# EAGLE design pinky 2.1 (EAGLE 6.4)
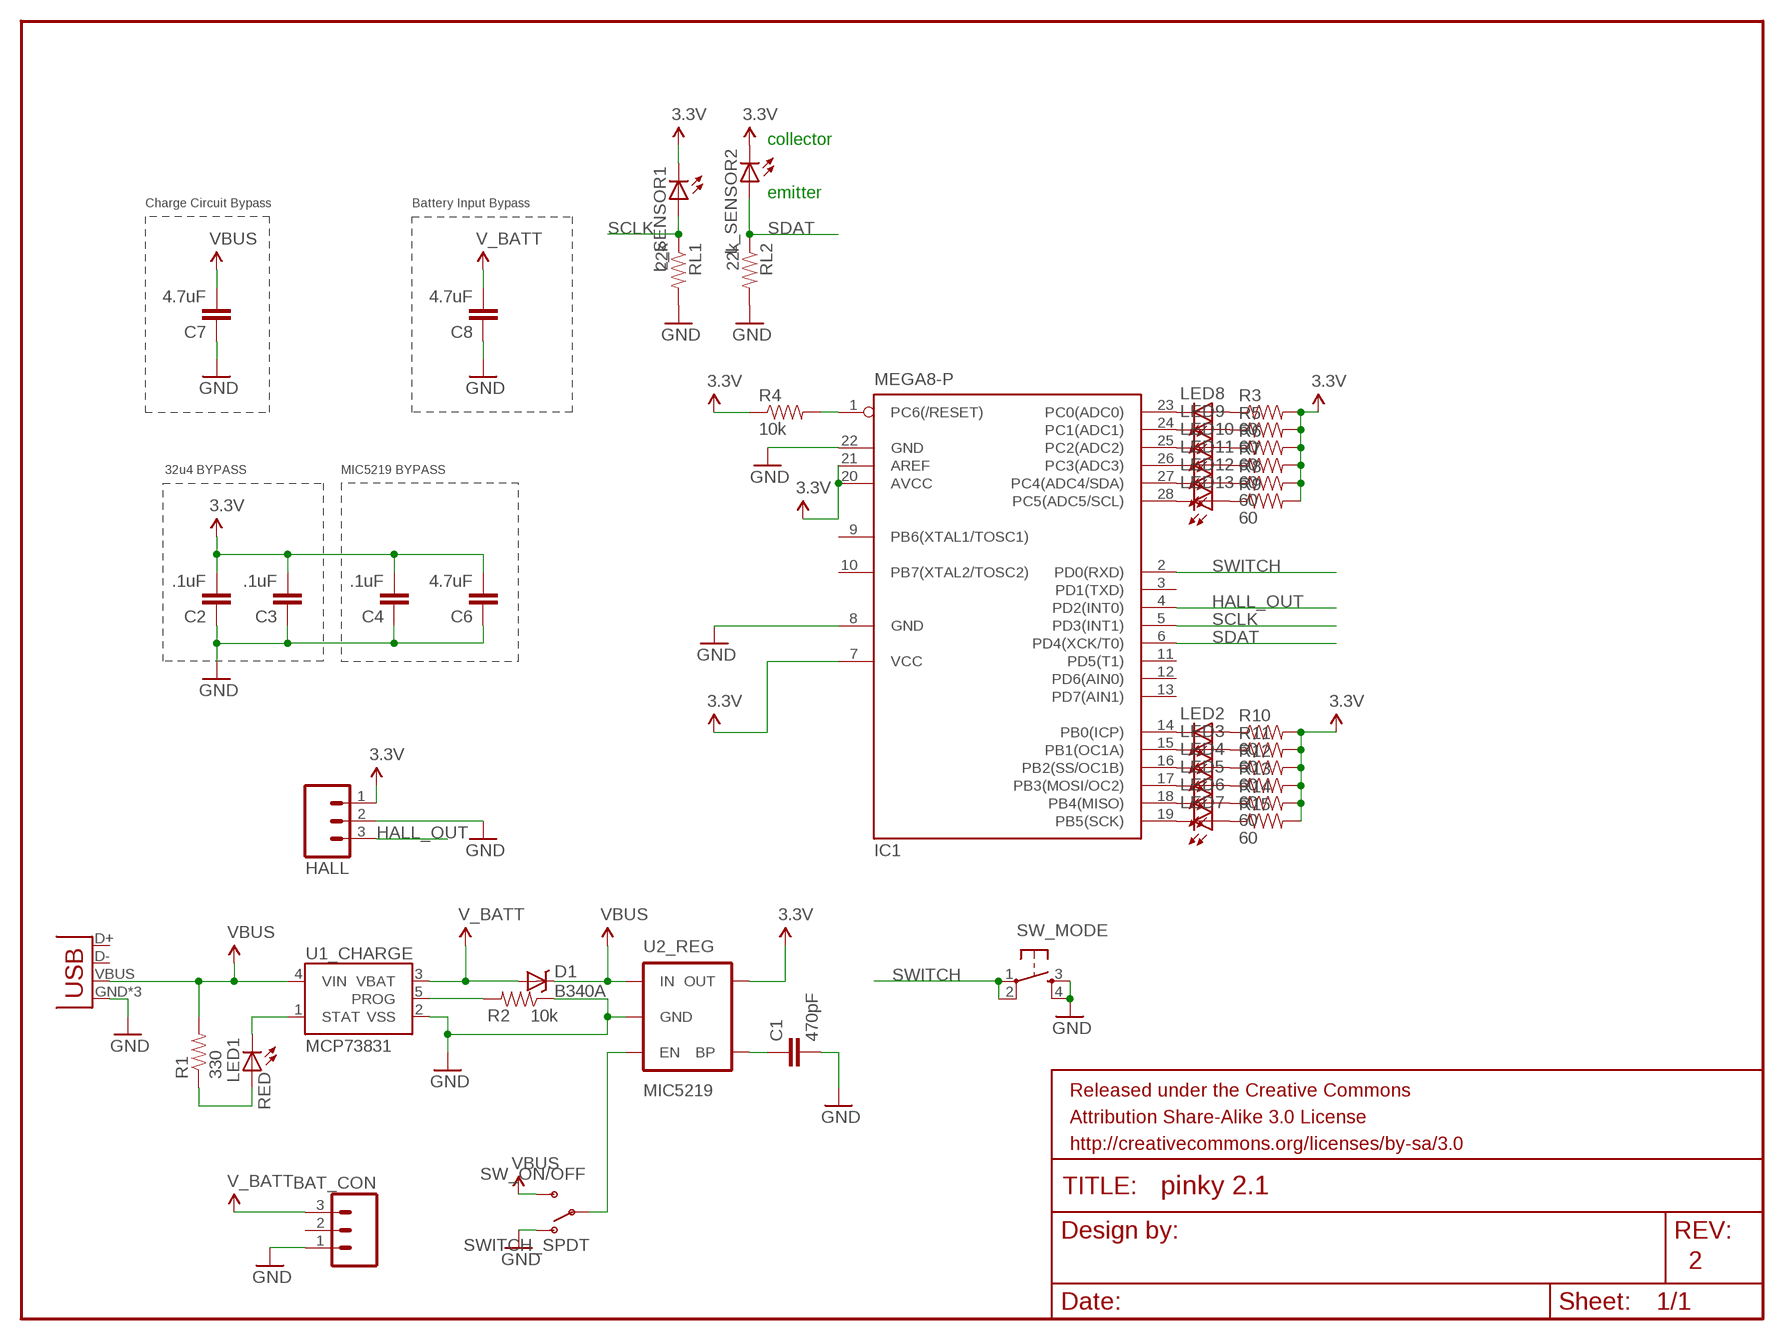
[diagram p0: schematic, sheet 1]

## Parts
BAT_CON  M03PTH  [1X03]
C1  470pF  CAP1206  [1206]
C2  .1uF  CAP1206  [1206]
C3  .1uF  CAP1206  [1206]
C4  .1uF  CAP1206  [1206]
C6  4.7uF  CAP1206  [1206]
C7  4.7uF  CAP1206  [1206]
C8  4.7uF  CAP1206  [1206]
D1  B340A  DIODE-SCHOTTKY_  [SMA-DIODE]
HALL  M03PTH  [1X03]
IC1  MEGA8-P  [DIL28-3]
L_SENSOR1  LED3MM  [LED3MM]
L_SENSOR2  LED3MM  [LED3MM]
LED1  RED  LED1206  [LED-1206]
LED2  LED1206  [LED-1206]
LED3  LED1206  [LED-1206]
LED4  LED1206  [LED-1206]
LED5  LED1206  [LED-1206]
LED6  LED1206  [LED-1206]
LED7  LED1206  [LED-1206]
LED8  LED1206  [LED-1206]
LED9  LED1206  [LED-1206]
LED10  LED1206  [LED-1206]
LED11  LED1206  [LED-1206]
LED12  LED1206  [LED-1206]
LED13  LED1206  [LED-1206]
R1  330  RESISTOR1206  [1206]
R2  10k  RESISTOR1206  [1206]
R3  60  RESISTOR1206  [1206]
R4  10k  RESISTOR1206  [1206]
R5  60  RESISTOR1206  [1206]
R6  60  RESISTOR1206  [1206]
R7  60  RESISTOR1206  [1206]
R8  60  RESISTOR1206  [1206]
R9  60  RESISTOR1206  [1206]
R10  60  RESISTOR1206  [1206]
R11  60  RESISTOR1206  [1206]
R12  60  RESISTOR1206  [1206]
R13  60  RESISTOR1206  [1206]
R14  60  RESISTOR1206  [1206]
R15  60  RESISTOR1206  [1206]
RL1  22k  RESISTOR1206  [1206]
RL2  22k  RESISTOR1206  [1206]
SW_MODE  TAC_SWITCHPTH  [TACTILE-PTH]
SW_ON/OFF  SWITCH_SPDT  [KPS-1290]
U1_CHARGE  MCP73831  [SOT23-5]
U2_REG  MIC5219  V_REG_MIC5219SMD  [SOT23-5]
X1_USB_MICRO  USB-MICROB  [USB-MICROB]

## Nets
3.3V: C2.2 C3.2 C4.2 C6.2 HALL.1 IC1.7(VCC) IC1.20(AVCC) IC1.21(AREF) L_SENSOR1.K(C) L_SENSOR2.K(C) R3.2 R4.1 R5.2 R6.2 R7.2 R8.2 R9.2 R10.2 R11.2 R12.2 R13.2 R14.2 R15.2 U2_REG.5(OUT)
5V: C7.2 D1.C R1.2 SW_ON/OFF.S U1_CHARGE.4(VIN) U2_REG.1(IN) X1_USB_MICRO.VBUS ; supply symbol labelled VBUS
GND: BAT_CON.1 C1.2 C2.1 C3.1 C4.1 C6.1 C7.1 C8.1 HALL.2 IC1.8(GND) IC1.22(GND) R2.1 RL1.2 RL2.2 SW_MODE.3 SW_MODE.4 SW_ON/OFF.O U1_CHARGE.2(VSS) U2_REG.2(GND) X1_USB_MICRO.GND X1_USB_MICRO.MT1(GND) X1_USB_MICRO.MT2(GND)
HALL_OUT: HALL.3 IC1.4(PD2(INT0))
N$1: IC1.1(PC6(/RESET)) R4.2
N$2: SW_ON/OFF.P U2_REG.3(EN)
N$3: LED1.A R1.1
N$4: LED1.C U1_CHARGE.1(STAT)
N$5: IC1.14(PB0(ICP)) LED2.C
N$6: R2.2 U1_CHARGE.5(PROG)
N$7: IC1.15(PB1(OC1A)) LED3.C
N$8: C1.1 U2_REG.4(BP)
N$9: IC1.16(PB2(SS/OC1B)) LED4.C
N$10: IC1.17(PB3(MOSI/OC2)) LED5.C
N$11: IC1.18(PB4(MISO)) LED6.C
N$12: IC1.19(PB5(SCK)) LED7.C
N$13: IC1.23(PC0(ADC0)) LED8.C
N$14: IC1.24(PC1(ADC1)) LED9.C
N$15: IC1.25(PC2(ADC2)) LED10.C
N$16: IC1.26(PC3(ADC3)) LED11.C
N$17: IC1.27(PC4(ADC4/SDA)) LED12.C
N$18: IC1.28(PC5(ADC5/SCL)) LED13.C
N$19: LED8.A R3.1
N$20: LED9.A R5.1
N$21: LED10.A R6.1
N$22: LED11.A R7.1
N$23: LED12.A R8.1
N$25: LED13.A R9.1
N$26: LED2.A R10.1
N$27: LED3.A R11.1
N$28: LED4.A R12.1
N$29: LED5.A R13.1
N$30: LED6.A R14.1
N$31: LED7.A R15.1
SCLK: IC1.5(PD3(INT1)) L_SENSOR1.A RL1.1
SDAT: IC1.6(PD4(XCK/T0)) L_SENSOR2.A RL2.1
SWITCH: IC1.2(PD0(RXD)) SW_MODE.1 SW_MODE.2
V_BATT: BAT_CON.3 C8.2 D1.A U1_CHARGE.3(VBAT)
Unconnected: BAT_CON.2 IC1.3(PD1(TXD)) IC1.9(PB6(XTAL1/TOSC1)) IC1.10(PB7(XTAL2/TOSC2)) IC1.11(PD5(T1)) IC1.12(PD6(AIN0)) IC1.13(PD7(AIN1)) X1_USB_MICRO.D+ X1_USB_MICRO.D-

## Notes on the sheet
- collector
- emitter
- Charge Circuit Bypass | Battery Input Bypass
- 32u4 BYPASS | MIC5219 BYPASS
- 2

## Library data of the parts
BAT_CON HALL = SparkFun-Connectors:M03: Header 3 Standard 3-pin 0.1" header. Use with straight break away headers (SKU : PRT-00116), right angle break away headers (PRT-00553), swiss pins (PRT-00743), machine pins (PRT-00117), and female headers (PRT-00115). Molex polarized connector foot print use with SKU : PRT-08232 with associated crimp pins and housings.
C1 = SparkFun-Passives:CAP: Capacitor Standard 0603 ceramic capacitor, and 0.1" leaded capacitor.; PROD_ID: CAP-07884
C2-C4 = SparkFun-Passives:CAP: Capacitor Standard 0603 ceramic capacitor, and 0.1" leaded capacitor.; PROD_ID: CAP-00810
C6 = SparkFun-Passives:CAP: Capacitor Standard 0603 ceramic capacitor, and 0.1" leaded capacitor.; PROD_ID: CAP-08280
C7 C8 = SparkFun-Passives:CAP: Capacitor Standard 0603 ceramic capacitor, and 0.1" leaded capacitor.; PROD_ID: CAP-10300
D1 = SparkFun-DiscreteSemi:DIODE-SCHOTTKY: Commonly MBRA140.; PROD_ID: DIO-09886
IC1 = atmel:MEGA8-P: MICROCONTROLLER 8 Kbytes FLASH, 1 kbytes SRAM, 512 bytes EEPROM, USART, 4-channel 10 bit ADC, 2-channel 8 bit ADC Pin compatible with Atmega48, ATMega88, ATMega168 Source: avr.lbr; OC_FARNELL: unknown; OC_NEWARK: unknown
L_SENSOR1 L_SENSOR2 LED2-LED13 = SparkFun-LED:LED: LEDs Standard schematic elements and footprints for 5mm, 3mm, 1206, and 0603 sized LEDs. 5mm - Spark Fun Electronics SKU : COM-00529 (and others)
LED1 = SparkFun-LED:LED: LEDs Standard schematic elements and footprints for 5mm, 3mm, 1206, and 0603 sized LEDs. 5mm - Spark Fun Electronics SKU : COM-00529 (and others); PROD_ID: DIO-00819
R1 = SparkFun-Passives:RESISTOR: Resistor Basic schematic elements and footprints for 0603, 1206, and PTH resistors.; PROD_ID: RES-00818
R2-R15 RL1 RL2 = SparkFun-Passives:RESISTOR: Resistor Basic schematic elements and footprints for 0603, 1206, and PTH resistors.; PROD_ID: RES-00824
SW_MODE = SparkFun-Electromechanical:TAC_SWITCH: Momentary Switch Button commonly used for reset or general input. Spark Fun Electronics SKU : COM-00097 SMT- SWCH-08247
SW_ON/OFF = SparkFun-Electromechanical:SWITCH_SPDT: Side-actuated SPDT slide switch, as used on the Arduino Pro
U1_CHARGE = SparkFun-PowerIC:MCP73831: Miniature single cell, fully integrated Li-Ion, Li-polymer charge management controller http://ww1.microchip.com/downloads/en/DeviceDoc/21984a.pdf; PROD_ID: IC-09995
U2_REG = SparkFun-PowerIC:V_REG_MIC5219: V_REG MIC5219 Standard 500mA LDO voltage regulator in SOT-23 layout. Micrel part MIC5219. BP (by-pass) pin is used to lower output noise with 470pF cap, may be left open.; PROD_ID: VREG-09872
X1_USB_MICRO = SparkFun-Connectors:USB: USB Connectors USB-B-PTH is fully proven SKU : PRT-00139 USB-miniB is fully proven SKU : PRT-00587 USB-A-PCB is untested. USB-A-H is throughly reviewed, but untested. Spark Fun Electronics SKU : PRT-00437 USB-B-SMT is throughly reviewed, but untested. Needs silkscreen touching up. USB-A-S has not been used/tested USB-MB-H has not been used/tested; PROD_ID: CONN-09505

## Board
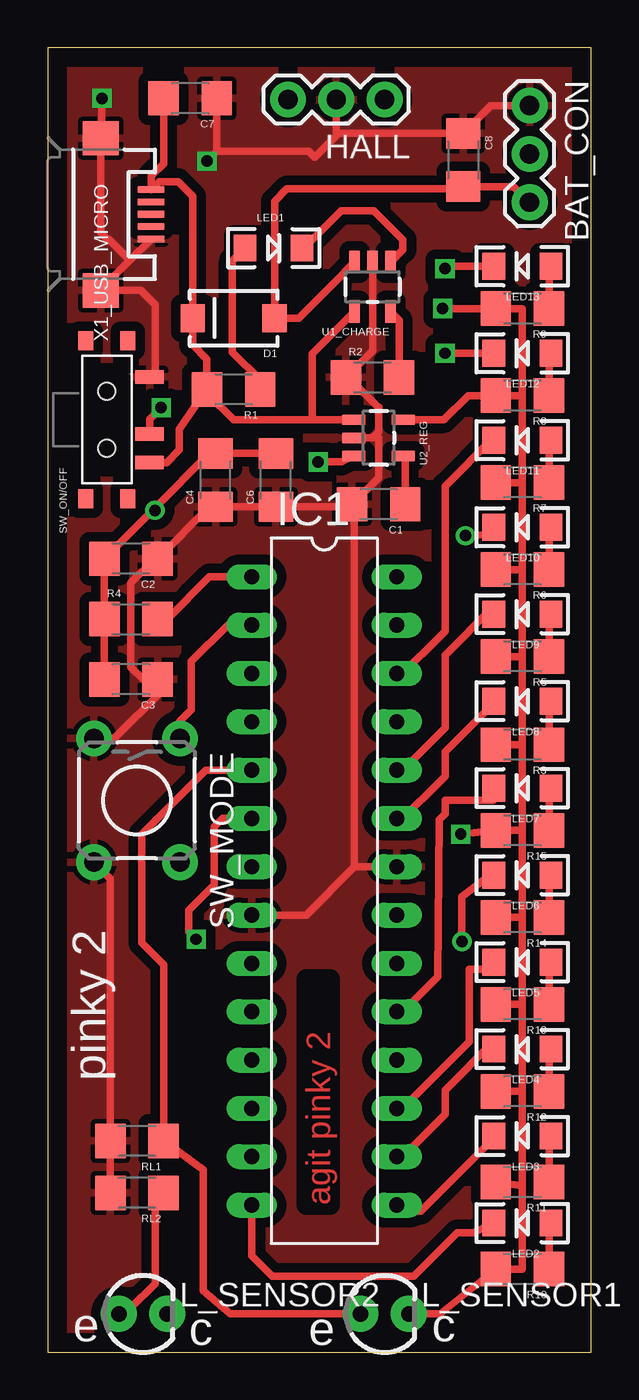
[diagram p1: board, top side]
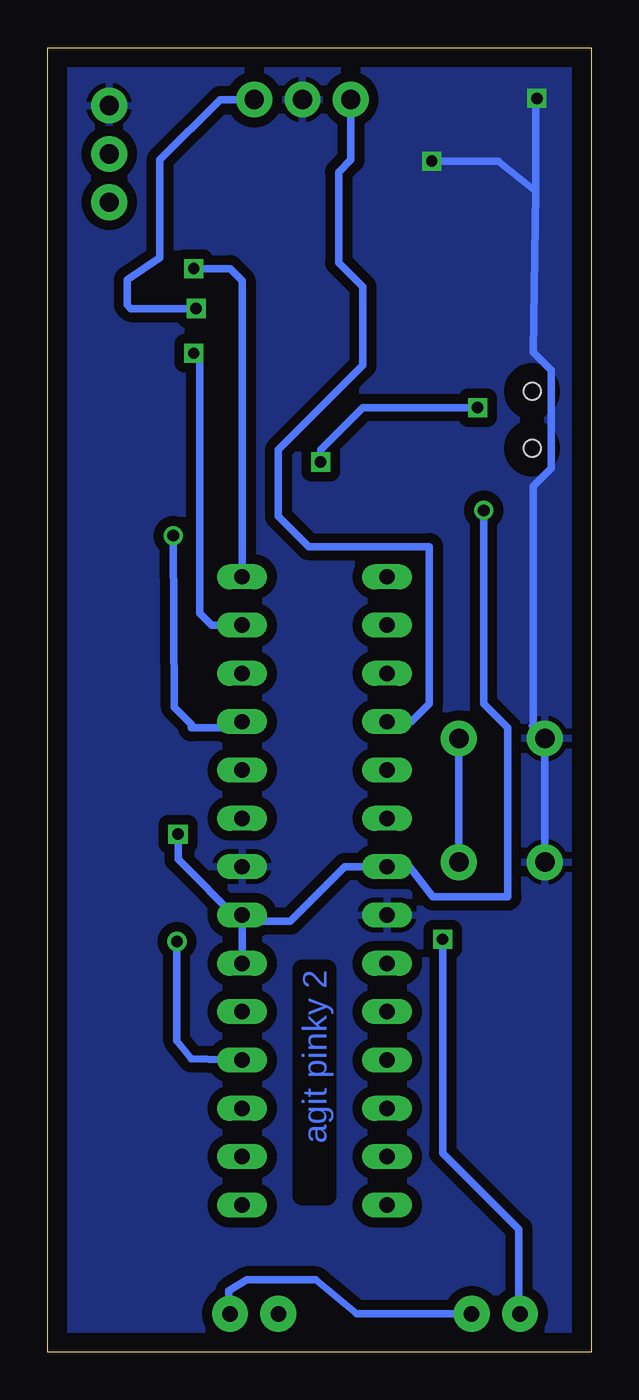
[diagram p2: board, bottom side, seen from below]

Size 28.57 x 68.58 mm. Coordinates in mm from the lower left corner, seen from the top.
Outline: 0,0 28.57,0 28.57,68.58 0,68.58 0,0
Copper layers (1*16): Top 0.035mm / dielectric 1.5mm / Bottom 0.035mm
Design rules "default *": minimum track width 16mil, minimum drill 24mil, track to track 8mil, track to pad 8mil, pad to pad 8mil, via to via 8mil, smd to smd 8mil, copper to edge 40mil, drill to drill 8mil, minimum pad ring 10mil, minimum via ring 8mil, stop-mask expansion 4mil, vias tented up to drill 0mil, thermal gap 10mil

### Footprints (pad centres in the part's own frame; a part is rotated, then mirrored left to right if it is on the bottom)
1X03 = drill 1.016 pad 1.88: 1 0,0; 2 2.54,0; 3 5.08,0
1206 = smd 1.6 x 1.8: 1 -1.4,0; 2 1.4,0
SMA-DIODE = smd 1.27 x 1.47: A -2.15,0; C 2.15,0
DIL28-3 = drill 0.813 long: 1 -16.51,-3.81; 2 -13.97,-3.81; 3 -11.43,-3.81; 4 -8.89,-3.81; 5 -6.35,-3.81; 6 -3.81,-3.81; 7 -1.27,-3.81; 8 1.27,-3.81; 9 3.81,-3.81; 10 6.35,-3.81; 11 8.89,-3.81; 12 11.43,-3.81; 13 13.97,-3.81; 14 16.51,-3.81; 15 16.51,3.81; 16 13.97,3.81; 17 11.43,3.81; 18 8.89,3.81; 19 6.35,3.81; 20 3.81,3.81; 21 1.27,3.81; 22 -1.27,3.81; 23 -3.81,3.81; 24 -6.35,3.81; 25 -8.89,3.81; 26 -11.43,3.81; 27 -13.97,3.81; 28 -16.51,3.81
LED3MM = drill 0.813 pad 1.88: A -1.27,0; K 1.27,0
LED-1206 = smd 1.2 x 1.4: A -1.5,0; C 1.5,0
TACTILE-PTH = drill 1.016 pad 1.88: 1 -3.251,2.261; 2 3.251,2.261; 3 -3.251,-2.261; 4 3.251,-2.261
KPS-1290 = smd 0.7 x 1.5: O -2.25,2.25; P 0.75,2.25; S 2.25,2.25 | smd 1 x 0.8: P$1 -4.15,1.1; P$2 -4.15,-1.1; P$3 4.15,-1.1; P$4 4.15,1.1 | hole 0.9: -1.5,0; 1.5,0
SOT23-5 = smd 0.55 x 1.2: 1 -0.95,-1.3; 2 0,-1.3; 3 0.95,-1.3; 4 0.95,1.3; 5 -0.95,1.3
USB-MICROB = smd 0.35 x 1.4: D+ 0,2.65; D- -0.65,2.65; GND 1.3,2.65; ID 0.65,2.65; VBUS -1.3,2.65 | smd 1.8 x 1.9: MT1 -4,0; MT2 4,0

### Placement (x,y rotation side)
BAT_CON  25.34,65.53 270 top
C1  17.4,44.58 180 top
C2  4.38,41.72 180 top
C3  4.38,35.37 180 top
C4  8.83,45.85 90 top
C6  12,45.85 90 top
C7  7.49,65.91 180 top
C8  21.84,62.67 270 top
D1  9.78,54.36 180 top
HALL  17.72,65.85 180 top
IC1  14.54,24.26 270 top
L_SENSOR1  17.72,2.03 0 top
L_SENSOR2  5.02,2.03 0 top
LED1  11.87,58.04 0 top
LED2  24.96,6.79 180 top
LED3  24.96,11.37 180 top
LED4  24.96,15.94 180 top
LED5  24.96,20.51 180 top
LED6  24.96,25.08 180 top
LED7  24.96,29.65 180 top
LED8  24.96,34.23 180 top
LED9  24.96,38.8 180 top
LED10  24.96,43.37 180 top
LED11  24.96,47.94 180 top
LED12  24.96,52.51 180 top
LED13  24.96,57.09 180 top
R1  9.78,50.61 180 top
R2  17.08,51.24 0 top
R3  24.96,31.94 180 top
R4  4.38,38.54 0 top
R5  24.96,36.58 180 top
R6  24.96,41.15 180 top
R7  24.96,45.72 180 top
R8  24.96,50.29 180 top
R9  24.96,54.86 180 top
R10  24.96,4.38 180 top
R11  24.96,8.95 180 top
R12  24.96,13.72 180 top
R13  24.96,18.29 180 top
R14  24.96,22.86 180 top
R15  24.96,27.43 180 top
RL1  4.7,11.11 180 top
RL2  4.7,8.38 180 top
SW_MODE  4.7,29.02 270 top
SW_ON/OFF  3.11,49.02 270 top
U1_CHARGE  17.08,56.01 180 top
U2_REG  17.4,48.07 270 top
X1_USB_MICRO  2.79,59.82 270 top

### Tracks (layer width: path | path; a pad name or v marks a point on that pad's centre or on a via)
3.3V  (via drill 0.6, 0.61)
  Top 0.406: C6.2 C4.2 8.51,47.25 5.59,44.33 | 5.59,44.33 C2.2 R4.1 C3.2 | 24.96,50.29 24.96,54.86 R9.2 v20.77,54.86 | 24.96,50.29 24.96,45.72 | 24.96,45.72 24.96,41.15 | 24.96,41.15 24.96,36.58 | 24.96,36.58 24.96,31.94 | 24.96,31.94 24.96,27.43 | 24.96,27.43 24.96,22.86 | 24.96,22.86 24.96,18.29 | 24.96,18.29 24.96,13.72 | 24.96,13.72 24.96,8.76 | 24.96,8.76 24.96,4.38 R10.2 20.63,2.03 L_SENSOR1.K | R11.2 24.96,8.76 | R12.2 24.96,13.72 | R13.2 24.96,18.29 | R14.2 24.96,22.86 | 24.96,27.43 R15.2 v21.72,27.24 | R3.2 24.96,31.94 | R5.2 24.96,36.58 | R6.2 24.96,41.15 | R7.2 24.96,45.72 | 24.96,50.29 R8.2 22.1,50.29 20.83,49.02 U2_REG.5 | v5.65,44.26 5.59,44.33
  Bottom 0.406: 18.35,22.67 IC1.21 18.03,22.67 15.81,22.67 12.95,25.53 IC1.7 9.59,25.59 8.32,23.94 4.38,23.94 4.38,32.83 5.65,34.1 v5.65,44.26 | 18.35,22.67 IC1.20 | HALL.1 19.49,65.85 22.67,62.67 22.67,57.53 24.38,56.39 24.38,55.05 24.19,54.86 v20.77,54.86 | L_SENSOR2.K 12.32,2.03 14.48,3.81 18.1,3.81 19.05,3.24 19.05,2.1 L_SENSOR1.K | 18.35,22.67 18.48,22.67 21.72,25.91 v21.72,27.24
5V
  Top 0.406: SW_ON/OFF.S 6.26,46.77 6.92,47.43 6.92,48.52 R1.2 | R1.2 8.38,50.42 9.78,49.02 13.91,49.02 | 13.91,49.02 U2_REG.1 13.91,49.02 | 13.91,49.02 13.91,52.48 U1_CHARGE.4 | R1.2 8.38,52.2 7.62,52.96 7.62,54.35 D1.C 7.63,60.76 6.86,61.53 5.86,61.53 X1_USB_MICRO.VBUS 5.44,61.83 6.1,62.48 C7.2
GND  (via drill 0.6)
  Top 0.406: 4.32,57.4 2.79,55.87 X1_USB_MICRO.MT2 4.89,55.82 5.65,55.05 5.65,51.56 SW_ON/OFF.O | 4.32,57.4 X1_USB_MICRO.GND | SW_MODE.3 3.5,32.27 5.97,34.73 5.97,35.18 C3.1 5.02,35.37 4.38,36.01 4.38,40.45 5.65,41.72 C2.1 8.51,44.45 C4.1 C6.1 | C1.2 17.4,45.98 17.4,48.07 U2_REG.2 17.08,48.07 17.4,48.39 17.4,49.66 15.81,51.24 R2.1 17.08,52.65 U1_CHARGE.2 | SW_MODE.4 3.3,24.91 RL1.2 RL2.2 | 16.13,25.53 IC1.22 | C6.1 12.45,44.45 12.64,44.26 12.19,44.26 C6.1 | C6.1 15.87,44.45 C1.2 | 15.18,63.94 14.04,62.8 13.72,63.12 8.89,63.12 | 15.18,63.94 HALL.2 | BAT_CON.1 23.3,65.53 C8.1 15.31,64.08 15.18,63.94 | IC1.8 13.59,22.99 16.13,25.53 | 16.13,25.53 16.13,44.45 C1.2 | 4.32,57.4 3.21,58.52 3.14,58.52 2.79,58.86 X1_USB_MICRO.MT1 2.86,63.88 v2.86,65.91 | C7.1 8.89,63.12 | 8.89,63.12 v8.38,62.61
  Bottom 0.406: SW_MODE.4 SW_MODE.3 3.11,32.94 3.05,32.94 3.05,45.53 2.1,46.48 2.1,51.63 3.05,52.58 2.92,61.02 | v8.38,62.61 4.89,62.61 2.92,61.02 | 2.92,61.02 2.92,65.85 v2.86,65.91
  pour Bottom (isolate 0.508): 0.19,68.2 28.38,68.2 28.38,0.19 0.19,0.19
  pour Top (isolate 0.508): 0.19,68.2 28.38,68.2 28.38,0.19 0.19,0.19
HALL_OUT
  Bottom 0.406: HALL.3 12.64,62.67 13.27,62.04 13.27,57.28 12,56.01 12,51.88 16.45,47.43 16.45,43.94 14.86,42.35 8.51,42.35 8.51,34.1 9.46,33.15 IC1.4
N$1
  Top 0.406: R4.2 6.29,38.54 8.51,40.77 IC1.1
N$2  (via drill 0.6)
  Top 0.406: SW_ON/OFF.P 5.36,49.05 v5.97,49.66 | v14.22,46.8 15.46,46.8 U2_REG.3
  Bottom 0.406: v5.97,49.66 12,49.66 14.22,47.43 v14.22,46.8
N$3
  Top 0.406: R1.1 11.18,51.11 9.72,52.58 9.72,57.38 LED1.A
N$4
  Top 0.406: LED1.C 13.46,58.04 15.43,60.01 17.14,60.01 18.67,58.48 18.67,57.95 U1_CHARGE.1
N$5
  Top 0.406: IC1.14 10.73,5.08 11.81,4 19.24,4 21.53,6.29 22.38,6.29 LED2.C
N$6
  Top 0.406: R2.2 18.48,54.26 U1_CHARGE.5
N$7
  Top 0.406: LED3.C 23.43,11.24 19.62,7.43 18.35,7.43 IC1.15
N$8
  Top 0.406: C1.1 18.8,47.02 U2_REG.4
N$9
  Top 0.406: LED4.C 23.43,16.32 20.89,13.78 20.89,12.51 18.35,9.97 IC1.16
N$10
  Top 0.406: LED5.C 23.43,20.13 22.16,20.13 22.16,16.32 18.35,12.51 IC1.17
N$11  (via drill 0.61)
  Top 0.406: v21.78,21.59 21.78,23.94 23.43,25.21 LED6.C
  Bottom 0.406: v21.78,21.59 21.78,16.38 21.02,15.43 IC1.18
N$12
  Top 0.406: LED7.C 23.43,29.02 20.89,29.02 20.89,28.32 20.57,28 20.51,19.75 18.35,17.59 IC1.19
N$13
  Top 0.406: LED8.C 23.43,34.1 20.89,31.56 20.89,30.29 18.35,27.75 IC1.23
N$14
  Top 0.406: LED9.C 23.43,39.18 20.89,36.64 20.89,32.83 18.35,30.29 IC1.24
N$15  (via drill 0.61)
  Top 0.406: v21.97,42.93 23.43,42.99 LED10.C
  Bottom 0.406: v21.97,42.93 21.91,33.91 21.02,33.02 21.02,32.83 18.35,32.83 IC1.25
N$16
  Top 0.406: LED11.C 23.43,48.07 20.89,45.53 20.89,37.91 18.35,35.37 IC1.26
N$17  (via drill 0.6)
  Top 0.406: v20.89,52.51 LED12.C
  Bottom 0.406: IC1.27 19.94,38.23 20.57,38.86 20.57,52.2 v20.89,52.51
N$18  (via drill 0.6)
  Top 0.406: LED13.C 21.02,57.09 v20.89,56.96
  Bottom 0.406: v20.89,56.96 18.99,56.96 18.35,56.33 IC1.28
N$19
  Top 0.406: LED8.A 26.36,34.23 R3.1
N$20
  Top 0.406: LED9.A 26.36,38.8 R5.1
N$21
  Top 0.406: LED10.A 26.36,43.37 R6.1
N$22
  Top 0.406: LED11.A 26.36,47.94 R7.1
N$23
  Top 0.406: LED12.A 26.36,52.51 R8.1
N$25
  Top 0.406: LED13.A 26.36,57.09 R9.1
N$26
  Top 0.406: LED2.A 26.36,6.79 R10.1
N$27
  Top 0.406: LED3.A 26.36,11.37 R11.1
N$28
  Top 0.406: LED4.A 26.36,15.94 R12.1
N$29
  Top 0.406: LED5.A 26.36,20.51 R13.1
N$30
  Top 0.406: LED6.A 26.36,25.08 R14.1
N$31
  Top 0.406: LED7.A 26.36,29.65 R15.1
SCLK
  Top 0.406: L_SENSOR1.A 9.59,2.03 8.19,3.24 8.19,9.59 RL1.1 6.1,20.38 4.95,21.53 4.95,27.24 8.32,30.61 IC1.5
SDAT  (via drill 0.6)
  Top 0.406: IC1.6 9.21,28.07 8.76,27.62 8.76,24.57 7.43,23.24 7.43,22.1 v7.81,21.72 | RL2.1 5.65,8.7 5.65,3.62 4.38,2.35 L_SENSOR2.A
  Bottom 0.406: v7.81,21.72 7.81,10.48 3.81,6.48 3.81,2.1 L_SENSOR2.A
SWITCH
  Top 0.406: SW_MODE.1 6.96,33.19 7.56,33.78 7.56,36.32 9.46,38.23 IC1.2
  Bottom 0.406: SW_MODE.1 SW_MODE.2
V_BATT
  Top 0.406: BAT_CON.3 24.51,61.27 C8.2 21.72,61.15 12.57,61.15 11.93,60.51 D1.A 13.21,54.36 15.62,56.77 15.62,56.8 U1_CHARGE.3

### Text on the board
Top: agit pinky 2
Bottom: agit pinky 2
tPlace: pinky 2 | e | c | c | e
tOrigins: - | +